# EAGLE design main (EAGLE 6.5.0)
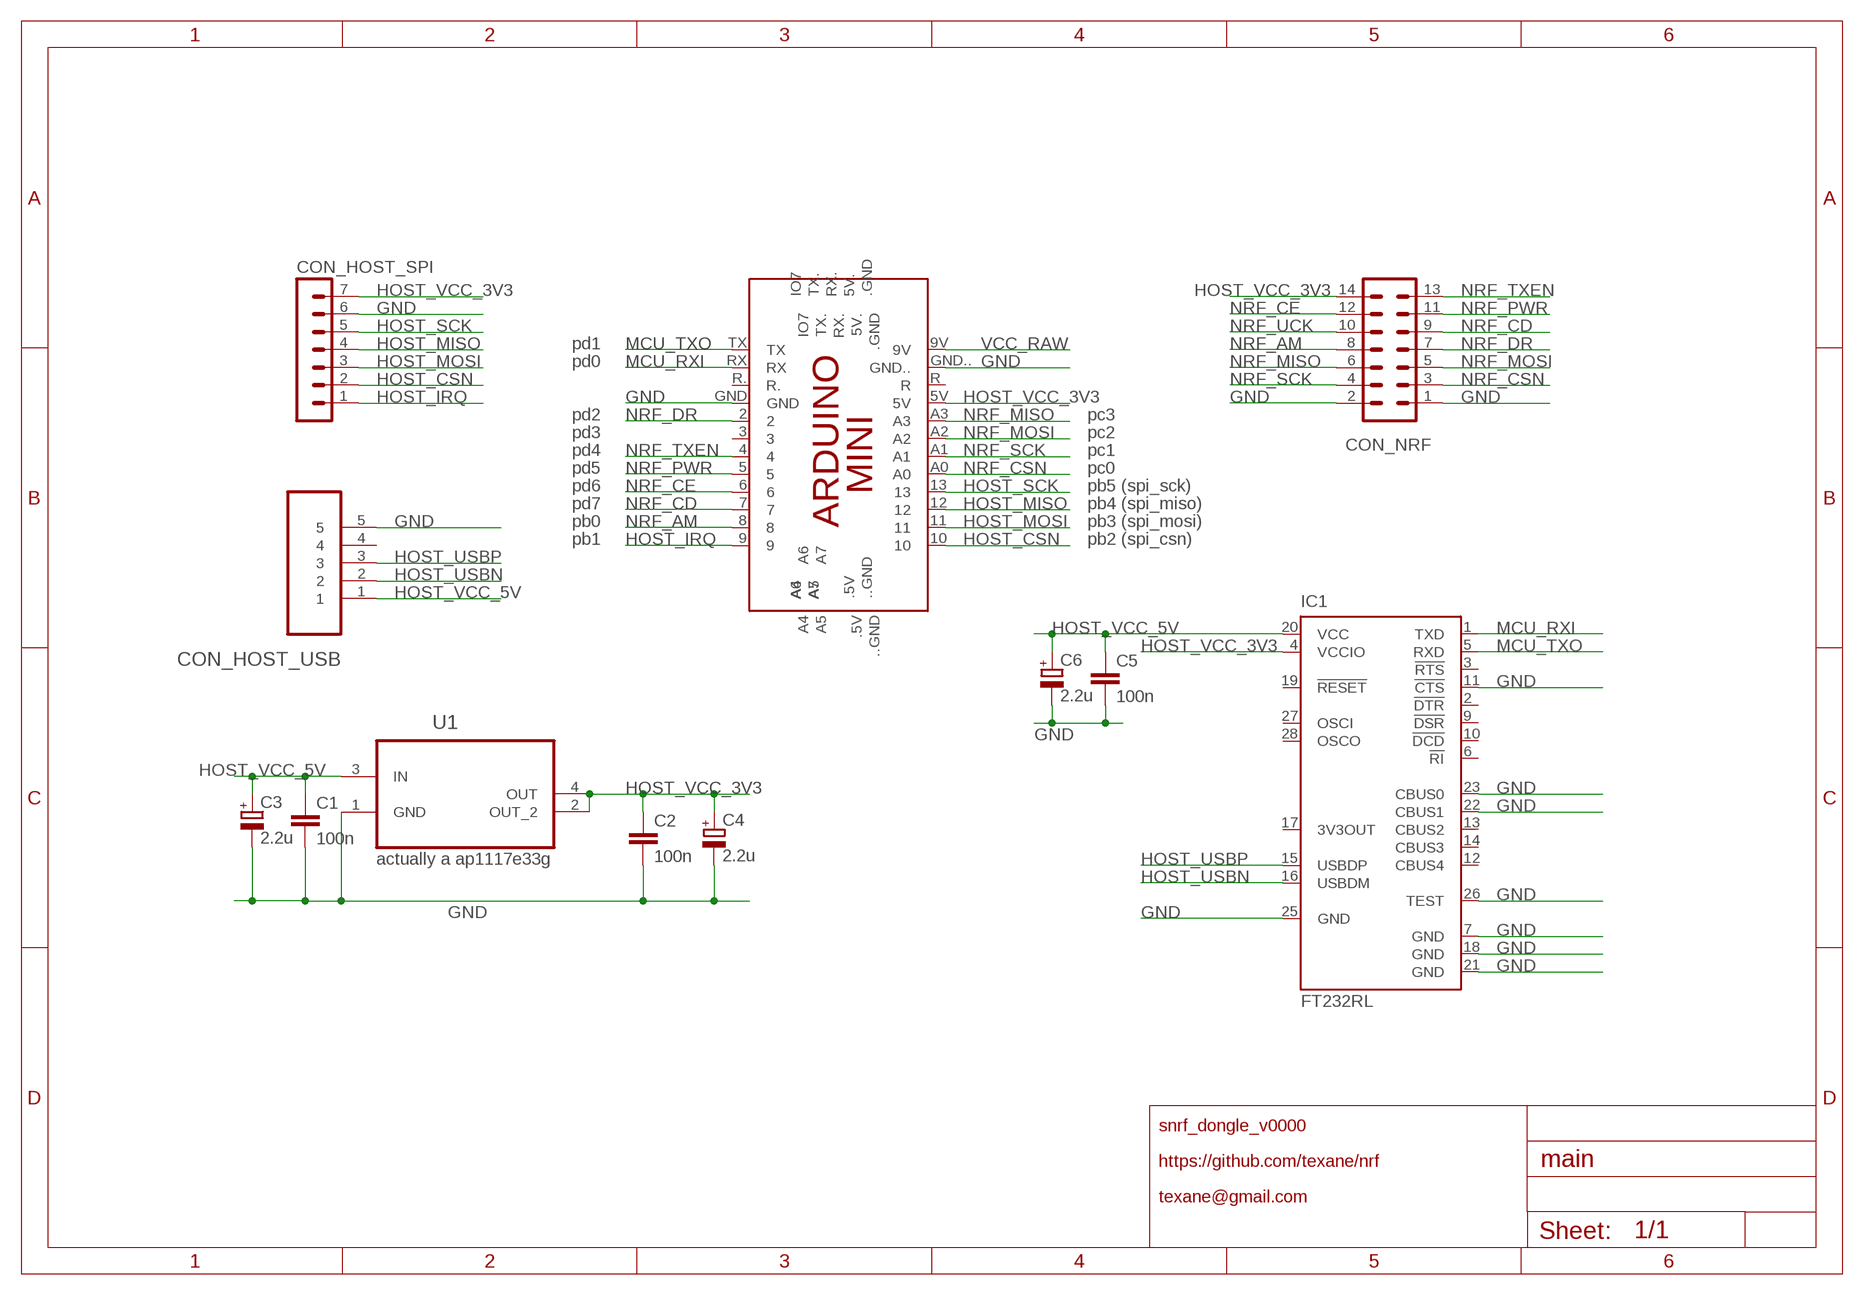
[diagram p0: schematic, sheet 1]

## Parts
C1  100n  C-EUC1206K  [C1206K]
C2  100n  C-EUC1206K  [C1206K]
C3  2.2u  CPOL-EUA/3216-18W  [A/3216-18W]
C4  2.2u  CPOL-EUA/3216-18W  [A/3216-18W]
C5  100n  C-EUC1206K  [C1206K]
C6  2.2u  CPOL-EUA/3216-18W  [A/3216-18W]
CON_HOST_SPI  MA07-1  [MA07-1]
CON_HOST_USB  47346-0001  [MOLEX_47346-0001]
CON_NRF  MA07-2  [MA07-2]
IC1  FT232RL  [SSOP28]
PCB1  ARDUINO_MINI  [ARDUINO_MINI]
U1  LDO33  ADP3338AKCZ-2.5RL7  [SOT230P700X180-4N]

## Nets
GND: C1.2 C2.2 C3.- C4.- C5.2 C6.- CON_HOST_SPI.6 CON_HOST_USB.5 CON_NRF.1 CON_NRF.2 IC1.7(GND) IC1.11(!CTS) IC1.18(GND) IC1.21(GND) IC1.22(CBUS1) IC1.23(CBUS0) IC1.25(GND) IC1.26(TEST) PCB1.GND PCB1.GND.. U1.1(GND)
HOST_CSN: CON_HOST_SPI.2 PCB1.10
HOST_IRQ: CON_HOST_SPI.1 PCB1.9
HOST_MISO: CON_HOST_SPI.4 PCB1.12
HOST_MOSI: CON_HOST_SPI.3 PCB1.11
HOST_SCK: CON_HOST_SPI.5 PCB1.13
HOST_USBN: CON_HOST_USB.2 IC1.16(USBDM)
HOST_USBP: CON_HOST_USB.3 IC1.15(USBDP)
HOST_VCC_3V3: C2.1 C4.+ CON_HOST_SPI.7 CON_NRF.14 IC1.4(VCCIO) PCB1.5V U1.2(OUT_2) U1.4(OUT)
HOST_VCC_5V: C1.1 C3.+ C5.1 C6.+ CON_HOST_USB.1 IC1.20(VCC) U1.3(IN)
MCU_RXI: IC1.1(TXD) PCB1.RX
MCU_TXO: IC1.5(RXD) PCB1.TX
NRF_AM: CON_NRF.8 PCB1.8
NRF_CD: CON_NRF.9 PCB1.7
NRF_CE: CON_NRF.12 PCB1.6
NRF_CSN: CON_NRF.3 PCB1.A0
NRF_DR: CON_NRF.7 PCB1.2
NRF_MISO: CON_NRF.6 PCB1.A3
NRF_MOSI: CON_NRF.5 PCB1.A2
NRF_PWR: CON_NRF.11 PCB1.5
NRF_SCK: CON_NRF.4 PCB1.A1
NRF_TXEN: CON_NRF.13 PCB1.4
NRF_UCK: CON_NRF.10
VCC_RAW: PCB1.9V
Unconnected: CON_HOST_USB.4 IC1.2(!DTR) IC1.3(!RTS) IC1.6(!RI) IC1.9(!DSR) IC1.10(!DCD) IC1.12(CBUS4) IC1.13(CBUS2) IC1.14(CBUS3) IC1.17(3V3OUT) IC1.19(!RESET) IC1.27(OSCI) IC1.28(OSCO) PCB1.3 PCB1.5V. PCB1..5V PCB1...GND PCB1..GND PCB1.A4 PCB1.A5 PCB1.A6 PCB1.A7 PCB1.IO7 PCB1.R PCB1.R. PCB1.RX. PCB1.TX.

## Notes on the sheet
- pd1
- pd0
- pd2 | pc3
- pd3 | pc2
- pd4 | pc1
- pd5 | pc0
- pd6 | pb5 (spi_sck)
- pd7 | pb4 (spi_miso)
- pb0 | pb3 (spi_mosi)
- pb1 | pb2 (spi_csn)
- actually a ap1117e33g
- snrf_dongle_v0000
- https://github.com/texane/nrf
- texane@gmail.com

## Library data of the parts
C1 C2 C5 = rcl:C-EU: CAPACITOR, European symbol
C3 C4 C6 = resistor:CPOL-EU: POLARIZED CAPACITOR, European symbol
CON_HOST_SPI = con-lstb:MA07-1: PIN HEADER; OC_FARNELL: unknown; OC_NEWARK: unknown
CON_HOST_USB = Molex-47346-0001:47346-0001: CONN RCPT 5POS MICRO USB R/A SMD; MPN: 47346-0001; OC_FARNELL: 1568026; OC_NEWARK: 47M0505; PACKAGE: 5 POS MICRO USB R/A; SUPPLIER: MOLEX
CON_NRF = con-lstb:MA07-2: PIN HEADER; OC_FARNELL: unknown; OC_NEWARK: unknown
IC1 = ftdichip:FT232R: Source: http://www.ftdichip.com/Documents/DataSheets/DS_FT232R_v104.pdf; MPN: FT232RL; OC_FARNELL: 1146032; OC_NEWARK: 91K9918
PCB1 = E14_Arduino:ARDUINO_MINI: Device for representing an Arduino Mini board with a footprint in an EAGLE design. Created by Dave Young for Element14. More EAGLE documentation at: http://www.element14.com/community/community/knode/cadsoft_eagle
U1 = ADP3338AKCZ:ADP3338AKCZ-2.5RL7: Low Dropout Regulator; MPN: ADP3338AKCZ-2.5RL7; OC_FARNELL: 1651282; OC_NEWARK: 19M8719; PACKAGE: SOT-223-3; SUPPLIER: Analog Devices

## Board
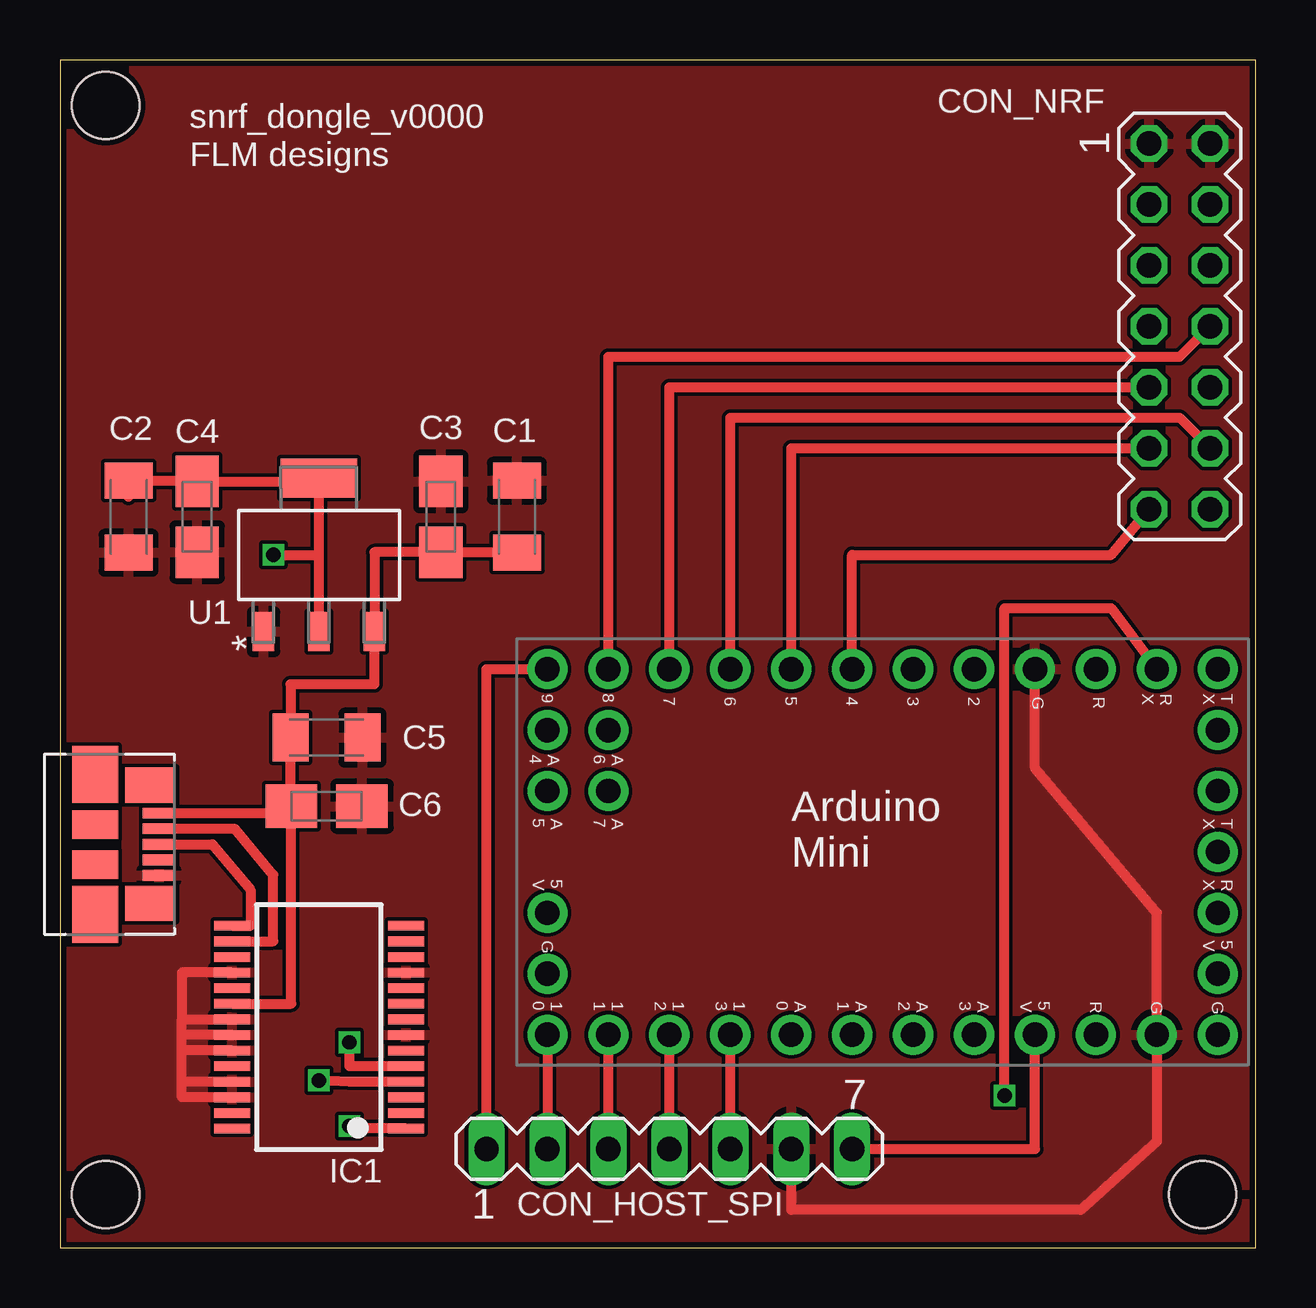
[diagram p1: board, top side]
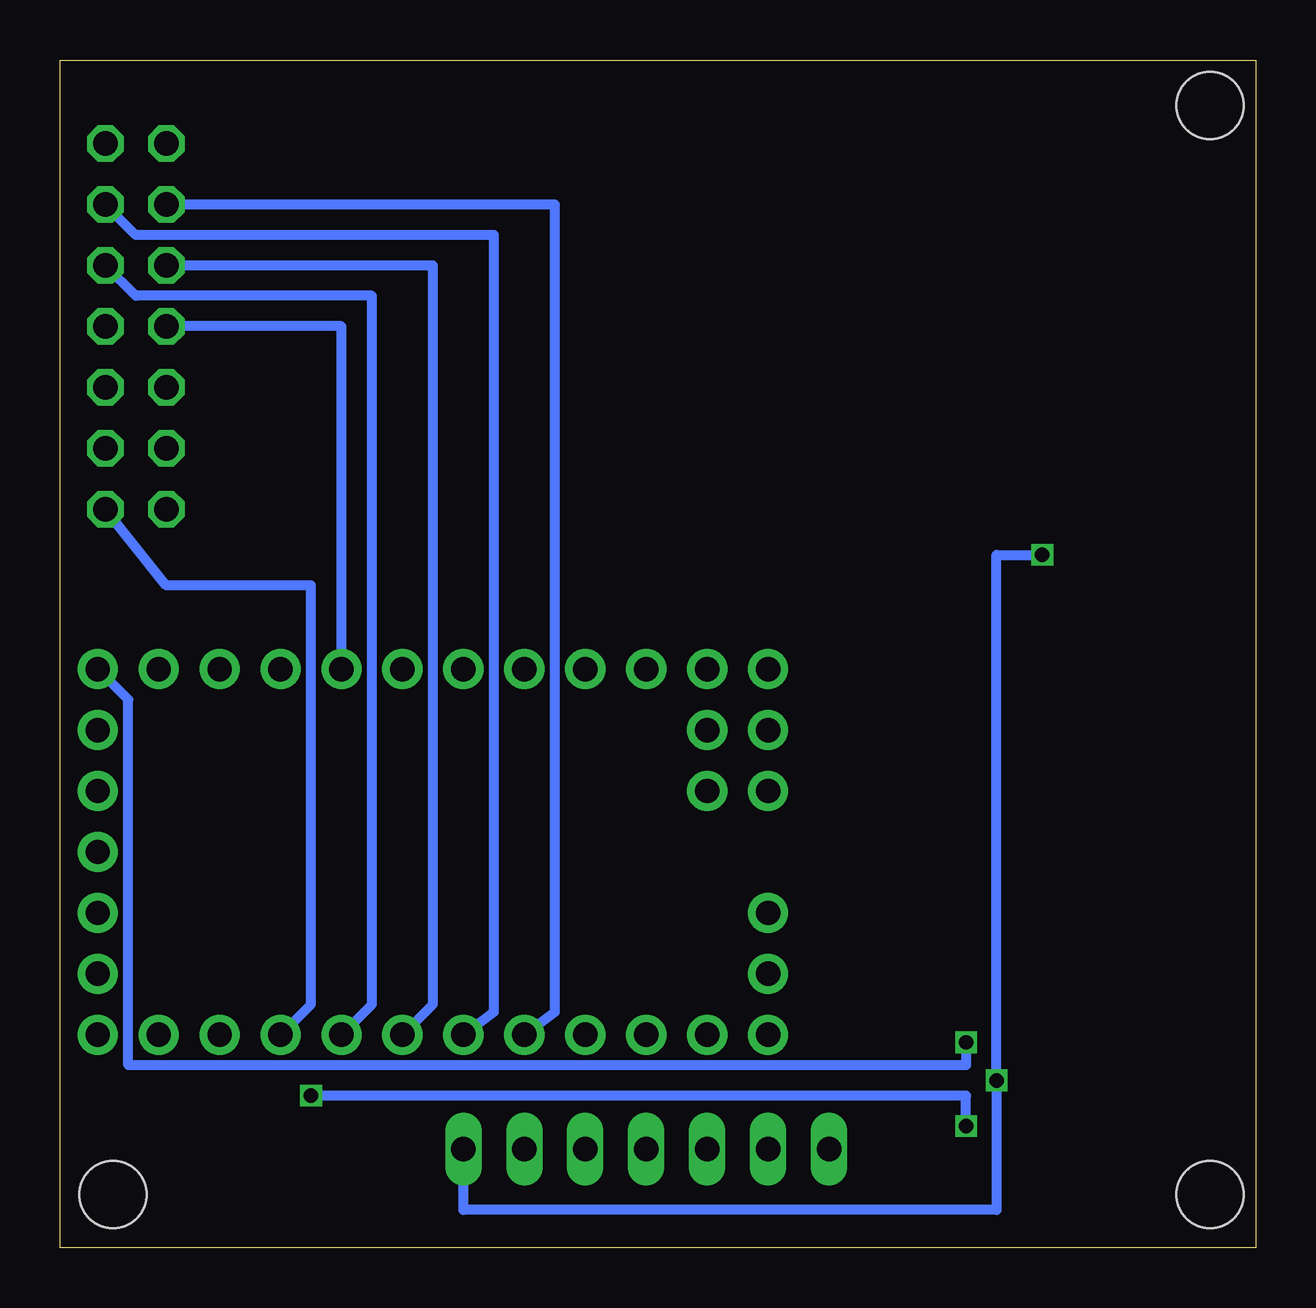
[diagram p2: board, bottom side, seen from below]

Size 49.84 x 49.52 mm. Coordinates in mm from the lower left corner, seen from the top.
Outline: 0,0 49.84,0 49.84,49.52 0,49.52 0,0
Copper layers (1*16): Top 0.035mm / dielectric 1.5mm / Bottom 0.035mm
Design rules "SeeedStudio_DRU_no_angle_2layer": minimum track width 6mil, minimum drill 12mil, track to track 6mil, track to pad 6mil, pad to pad 6mil, via to via 6mil, smd to smd 0mil, copper to edge 10mil, drill to drill 10mil, minimum pad ring 10mil, minimum via ring 6mil, stop-mask expansion 2mil, vias tented up to drill 25mil, thermal gap 10mil
Holes 2.8 mm at 1.91,47.62 1.91,2.22 47.62,2.22

### Footprints (pad centres in the part's own frame; a part is rotated, then mirrored left to right if it is on the bottom)
C1206K = smd 1.5 x 2: 1 -1.5,0; 2 1.5,0
A/3216-18W = smd 2.15 x 1.8: + 1.475,0; - -1.475,0
MA07-1 = drill 1.016 long: 1 -7.62,0; 2 -5.08,0; 3 -2.54,0; 4 0,0; 5 2.54,0; 6 5.08,0; 7 7.62,0
MOLEX_47346-0001 = smd 0.45 x 1.38: 1 -1.3,0; 2 -0.65,0; 3 0,0; 4 0.65,0; 5 1.3,0 | smd 1.475 x 2.1: M1 -2.462,-0.36; M2 2.462,-0.36 | smd 2.375 x 1.9: M3 -2.913,-2.66; M6 2.913,-2.66 | smd 1.175 x 1.9: M4 -0.82,-2.66; M5 0.85,-2.66
MA07-2 = drill 1.016 octagon: 1 -7.62,-1.27; 2 -7.62,1.27; 3 -5.08,-1.27; 4 -5.08,1.27; 5 -2.54,-1.27; 6 -2.54,1.27; 7 0,-1.27; 8 0,1.27; 9 2.54,-1.27; 10 2.54,1.27; 11 5.08,-1.27; 12 5.08,1.27; 13 7.62,-1.27; 14 7.62,1.27
SSOP28 = smd 0.4 x 1.5: 1 -4.225,-3.625; 2 -3.575,-3.625; 3 -2.925,-3.625; 4 -2.275,-3.625; 5 -1.625,-3.625; 6 -0.975,-3.625; 7 -0.325,-3.625; 8 0.325,-3.625; 9 0.975,-3.625; 10 1.625,-3.625; 11 2.275,-3.625; 12 2.925,-3.625; 13 3.575,-3.625; 14 4.225,-3.625; 15 4.225,3.625; 16 3.575,3.625; 17 2.925,3.625; 18 2.275,3.625; 19 1.625,3.625; 20 0.975,3.625; 21 0.325,3.625; 22 -0.325,3.625; 23 -0.975,3.625; 24 -1.625,3.625; 25 -2.275,3.625; 26 -2.925,3.625; 27 -3.575,3.625; 28 -4.225,3.625
ARDUINO_MINI = drill 1.016 pad 1.676: 2 19.05,16.51; 3 16.51,16.51; 4 13.97,16.51; 5 11.43,16.51; 5V 21.59,1.27; 5V. 29.21,6.35; 6 8.89,16.51; 7 6.35,16.51; 8 3.81,16.51; 9 1.27,16.51; 9V 29.21,1.27; 10 1.27,1.27; 11 3.81,1.27; 12 6.35,1.27; 13 8.89,1.27; .5V 1.27,6.35; ..GND 1.27,3.81; .GND 29.21,3.81; A0 11.43,1.27; A1 13.97,1.27; A2 16.51,1.27; A3 19.05,1.27; A4 1.27,13.97; A5 1.27,11.43; A6 3.81,13.97; A7 3.81,11.43; GND 21.59,16.51; GND.. 26.67,1.27; IO7 29.21,13.97; R 24.13,1.27; R. 24.13,16.51; RX 26.67,16.51; RX. 29.21,8.89; TX 29.21,16.51; TX. 29.21,11.43
SOT230P700X180-4N = smd 1.626 x 0.889: 1 -3.2,2.311; 2 -3.2,0; 3 -3.2,-2.311 | smd 1.626 x 3.175: 4 3.2,0

### Placement (x,y rotation side)
C1  19.05,30.48 90 top
C2  2.86,30.48 270 top
C3  15.88,30.48 270 top
C4  5.71,30.48 90 top
C5  11.11,21.27 0 top
C6  11.11,18.41 180 top
CON_HOST_SPI  25.4,4.13 0 top
CON_HOST_USB  4.13,16.83 270 top
CON_NRF  46.67,38.42 270 top
IC1  10.79,9.21 90 top
PCB1  19.05,7.62 0 top
U1  10.79,28.89 90 top

### Tracks (layer width: path | path; a pad name or v marks a point on that pad's centre or on a via)
GND
  Top 0.406: CON_HOST_SPI.6 30.48,1.59 42.55,1.59 45.72,4.45 PCB1.GND.. 45.72,13.97 40.64,20 PCB1.GND | IC1.18 5.08,11.48 5.08,9.53 | 5.08,9.53 IC1.21 | IC1.23 5.08,8.23 | 5.08,8.23 5.08,8.88 | 5.08,9.53 5.08,8.89 5.08,8.88 | IC1.26 5.08,6.28 5.08,6.93 | 5.08,6.93 5.08,8.23 | IC1.25 5.08,6.93 | IC1.22 5.08,8.88
  pour Top (isolate 0.127): 0,49.53 49.85,49.53 49.85,0 0,0
HOST_CSN
  Top 0.406: PCB1.10 CON_HOST_SPI.2
HOST_IRQ
  Top 0.406: CON_HOST_SPI.1 17.78,24.13 PCB1.9
HOST_MISO
  Top 0.406: CON_HOST_SPI.4 PCB1.12
HOST_MOSI
  Top 0.406: CON_HOST_SPI.3 PCB1.11
HOST_SCK
  Top 0.406: CON_HOST_SPI.5 PCB1.13
HOST_USBN
  Top 0.406: IC1.16 8.89,12.78 8.89,15.56 7.3,17.46 4.13,17.46 CON_HOST_USB.2
HOST_USBP
  Top 0.406: CON_HOST_USB.3 6.35,16.83 7.94,14.92 7.94,13.43 IC1.15 6.67,13.43
HOST_VCC_3V3  (via drill 0.6)
  Top 0.406: CON_HOST_SPI.7 40.64,4.13 PCB1.5V | IC1.4 12.06,6.93 v10.79,6.99 | 2.86,31.32 C2.1 5.71,31.98 C4.+ 10.79,31.95 | v8.89,28.89 10.79,28.89 | U1.2 10.79,28.89 | 10.79,28.89 U1.4
  Top 0.813: 10.79,31.95 U1.4
  Bottom 0.406: PCB1.5V 39.37,10.16 39.37,27.62 45.4,27.62 CON_NRF.14 | CON_HOST_SPI.7 33.02,1.59 10.79,1.59 v10.79,6.99 10.79,28.89 v8.89,28.89
HOST_VCC_5V
  Top 0.406: IC1.20 9.64,10.18 C6.+ | CON_HOST_USB.1 9.64,18.13 C6.+ | C6.+ 9.61,18.41 C5.1 9.61,23.5 13.11,23.5 U1.3 13.11,29 C3.+ 19.37,29 C1.1
MCU_RXI  (via drill 0.6)
  Top 0.406: IC1.1 12.38,4.98 v12.06,5.08 | v39.37,6.35 39.37,26.67 43.81,26.67 PCB1.RX
  Bottom 0.406: v12.06,5.08 12.06,6.35 v39.37,6.35
MCU_TXO  (via drill 0.6)
  Top 0.406: IC1.5 12.06,7.58 v12.06,8.57
  Bottom 0.406: v12.06,8.57 12.06,7.62 46.99,7.62 46.99,22.86 PCB1.TX
NRF_AM
  Top 0.406: PCB1.8 22.86,37.15 46.67,37.15 CON_NRF.8
NRF_CD
  Top 0.406: PCB1.7 25.4,35.88 CON_NRF.9
NRF_CE
  Top 0.406: PCB1.6 27.94,34.61 46.67,34.61 CON_NRF.12
NRF_CSN
  Bottom 0.406: PCB1.A0 29.21,9.84 29.21,43.5 CON_NRF.3
NRF_DR
  Bottom 0.406: PCB1.2 38.1,38.42 CON_NRF.7
NRF_MISO
  Bottom 0.406: PCB1.A3 36.83,10.16 36.83,39.69 46.67,39.69 CON_NRF.6
NRF_MOSI
  Bottom 0.406: PCB1.A2 34.29,10.16 34.29,40.96 CON_NRF.5
NRF_PWR
  Top 0.406: PCB1.5 30.48,33.34 CON_NRF.11
NRF_SCK
  Bottom 0.406: PCB1.A1 31.75,9.84 31.75,42.23 46.67,42.23 CON_NRF.4
NRF_TXEN
  Top 0.406: PCB1.4 33.02,28.89 43.81,28.89 CON_NRF.13

### Text on the board
tNames: snrf_dongle_v0000 | FLM designs